# Altium schematic sheet SWR_VHF.SchDoc: VHF SWR Meter
size A4; DocumentNumber: 18; Revision: 2.0; SheetNumber: 18; SheetTotal: 18
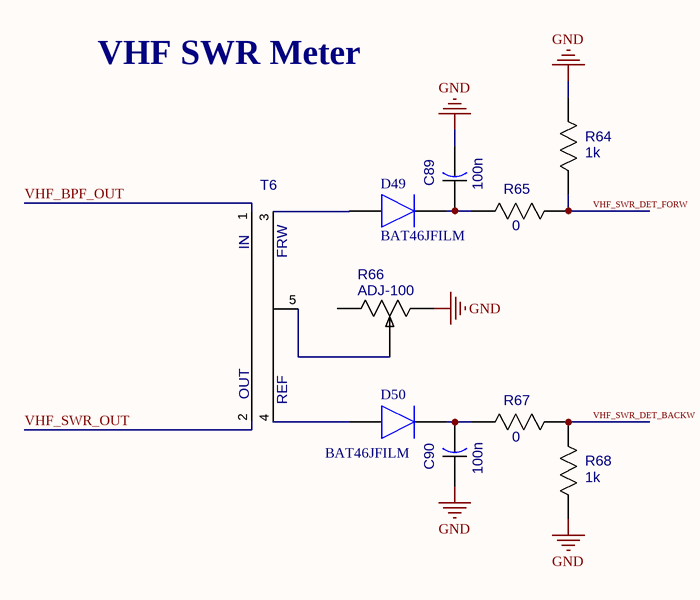
[diagram p0: SWR_VHF.SchDoc]

## Parts
C89  100n  [CAP_0805]
C90  100n  [CAP_0805]
D49  BAT46JFILM  [SOD2513X117N]
D50  BAT46JFILM  [SOD2513X117N]
R64  1k  [RES_0805]
R65  0  [RES_0805]
R66  ADJ-100  [306J]
R67  0  [RES_0805]
R68  1k  [RES_0805]
T6  SWR_VHF  [SWR_VHF]  (value not drawn)

## Nets
GND: C89.2 C90.1 R64.2 R66.1(CCW) R68.1
VHF_BPF_OUT: T6.1
VHF_SWR_DET_BACKW: R67.2 R68.2
VHF_SWR_DET_FORW: R64.1 R65.2
VHF_SWR_OUT: T6.2
NetC89_1: C89.1 D49.1(K) R65.1
NetC90_2: C90.2 D50.1(K) R67.1
NetD49_2: D49.2(A) T6.3
NetD50_2: D50.2(A) T6.4
NetR66_2: R66.2(W) T6.5

Not connected (* = marked no-connect by the designer): R66 3(CW)

## Notes on the sheet
- VHF SWR Meter
- Title
- Size:
- Date:
- A4
- Number:
- Time:
- Revision:
- Sheet
- of
- File:
- (in symbol SWR_VHF) IN; FRW; OUT; REF

## Library data of the parts
C89 C90 = CAP_0805: Value: 100n
D49 D50 = BAT46JFILM: Diode; Manufacturer_Name: STMicroelectronics; Allied_Number: 70389791; Datasheet Link: http://www.st.com/web/en/resource/technical/document/datasheet/CD00004930.pdf; Height: 1.17mm; Manufacturer_Part_Number: BAT46JFILM; Mouser Part Number: 511-BAT46JFILM; Mouser Price/Stock: https://www.mouser.co.uk/ProductDetail/STMicroelectronics/BAT46JFILM?qs=69%252BgXnvv5lrVjJqgcSQKbQ%3D%3D; RS Part Number: 7146847P; RS Price/Stock: http://uk.rs-online.com/web/p/products/7146847P; Allied Price/Stock: http://www.alliedelec.com/stmicroelectronics-bat46jfilm/70389791/
R64 R65 R67 R68 = RES_0805
R66 = 306J
T6 = SWR_VHF: Value: *